# EAGLE design nand (EAGLE 9.5.0)
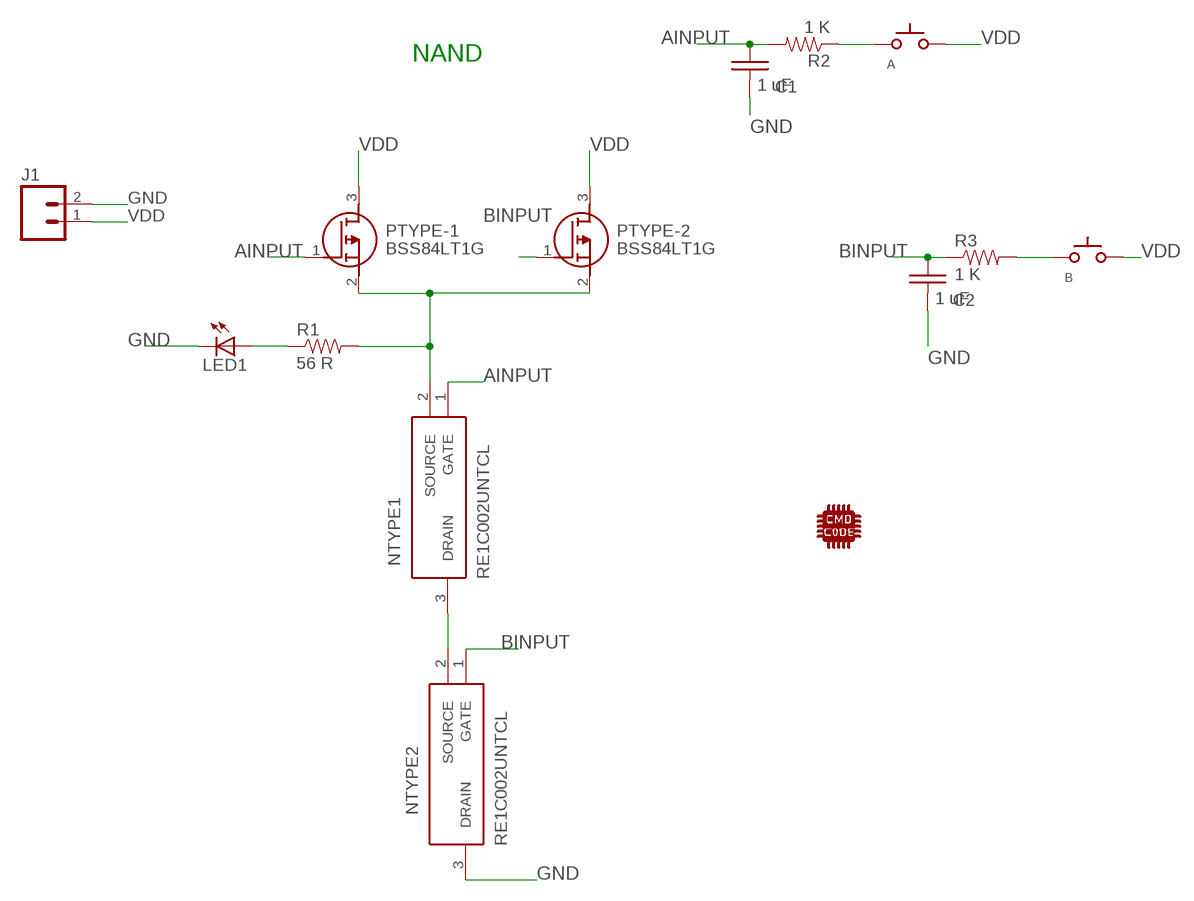
[diagram p0: schematic, sheet 1]

## Parts
A  SWITCH_TACTILETACTILE-2PIN-NARROW  [TACTILE-2PIN-NARROW]
B  SWITCH_TACTILETACTILE-2PIN-NARROW  [TACTILE-2PIN-NARROW]
C1  1 uF  C-USC1206  [C1206]
C2  1 uF  C-USC1206  [C1206]
J1  M021X02_NO_SILK  [1X02_NO_SILK]
LED1  LED3MM  [LED3MM]
NTYPE1  RE1C002UNTCL  [SOT50P160X85-3N]
NTYPE2  RE1C002UNTCL  [SOT50P160X85-3N]
PTYPE-1  BSS84LT1G  [SOT96P237X111-3N]
PTYPE-2  BSS84LT1G  [SOT96P237X111-3N]
R1  56 R  RESISTOR1206  [1206]
R2  1 K  RESISTOR0805-RES  [0805]
R3  1 K  RESISTOR0805-RES  [0805]
U$1  CMD_C0DE_LOGOCMD_CODE_LOGO_TOP_COPPER  [CMD_C0DE_LOGO_TOP_COPPER]

## Nets
AINPUT: C1.1 NTYPE1.1(GATE) PTYPE-1.1(G) R2.2
BINPUT: C2.1 NTYPE2.1(GATE) PTYPE-2.1(G) R3.1
GND: C1.2 C2.2 J1.2 LED1.K(C) NTYPE2.3(DRAIN)
N$1: A.P$2(C) R2.1
N$3: NTYPE1.2(SOURCE) PTYPE-1.2(S) PTYPE-2.2(S) R1.2
N$4: NTYPE1.3(DRAIN) NTYPE2.2(SOURCE)
N$5: LED1.A R1.1
N$7: B.P$2(C) R3.2
VDD: A.P$1(A) B.P$1(A) J1.1 PTYPE-1.3(D) PTYPE-2.3(D)

## Notes on the sheet
- NAND

## Library data of the parts
A B = switches:SWITCH_TACTILE
C1 C2 = passives:C-US: CAPACITOR, American symbol
J1 = connector:M02: Standard 2-pin 0.1" header. Use with - straight break away headers ( PRT-00116) - right angle break away headers (PRT-00553) - swiss pins (PRT-00743) - machine pins (PRT-00117) - female headers (PRT-00115) Molex polarized connector foot print use with: PRT-08233 with associated crimp pins and housings. 2.54_SCREWTERM for use with PRT-10571. 3.5mm Screw Terminal footprints for PRT-08084 5mm Screw Terminal footprints for use with PRT-08432
LED1 = leds:LED: LEDs Standard schematic elements and footprints for 5mm, 3mm, 1206, and 0603 sized LEDs. 5mm - Spark Fun Electronics SKU : COM-00529 (and others)
NTYPE1 NTYPE2 = transitors:RE1C002UNTCL: MOSFET 1.2V Drive Nch MOSFET Source: Datasheet <https://componentsearchengine.com/Datasheets/1/RE1C002UNTCL.pdf>; DESCRIPTION: MOSFET 1.2V Drive Nch MOSFET; HEIGHT: 0.85mm; MANUFACTURER_NAME: ROHM Semiconductor; MANUFACTURER_PART_NUMBER: RE1C002UNTCL; MOUSER_PART_NUMBER: 755-RE1C002UNTCL; MOUSER_PRICE-STOCK: https://www.mouser.com/Search/Refine.aspx?Keyword=755-RE1C002UNTCL
PTYPE-1 PTYPE-2 = transitors:BSS84LT1G: MOSFET 50V 130mA P-Channel Source: Datasheet <https://componentsearchengine.com/Datasheets/1/BSS84LT1G.pdf>; DESCRIPTION: MOSFET 50V 130mA P-Channel; HEIGHT: 1.11mm; MANUFACTURER_NAME: ON Semiconductor; MANUFACTURER_PART_NUMBER: BSS84LT1G; MOUSER_PART_NUMBER: 863-BSS84LT1G; MOUSER_PRICE-STOCK: https://www.mouser.com/Search/Refine.aspx?Keyword=863-BSS84LT1G
R1-R3 = passives:RESISTOR: Resistor Basic schematic elements and footprints for 0603, 1206, and PTH resistors.
U$1 = logos:CMD_C0DE_LOGO

## Board
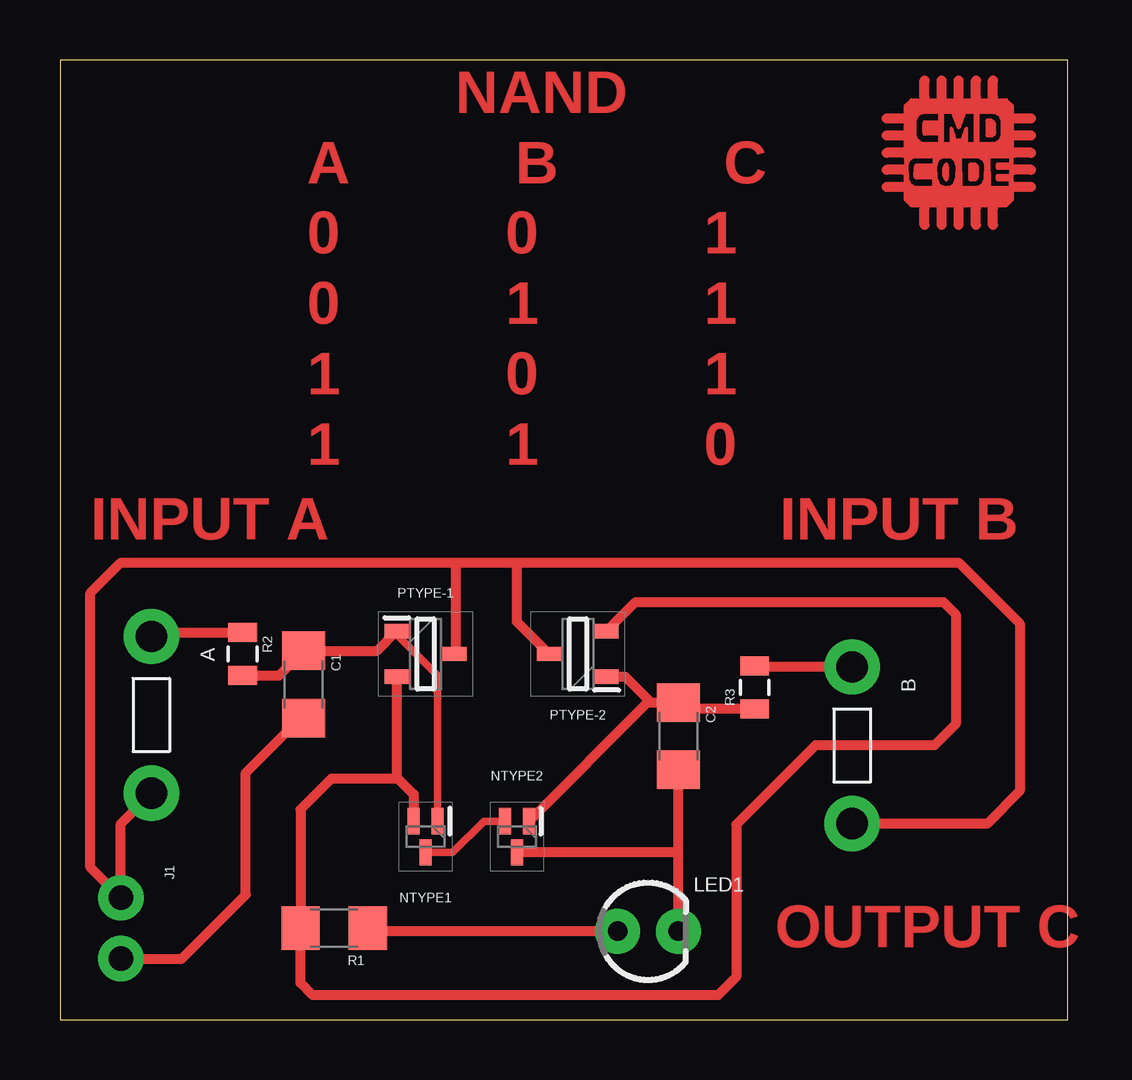
[diagram p1: board, top side]
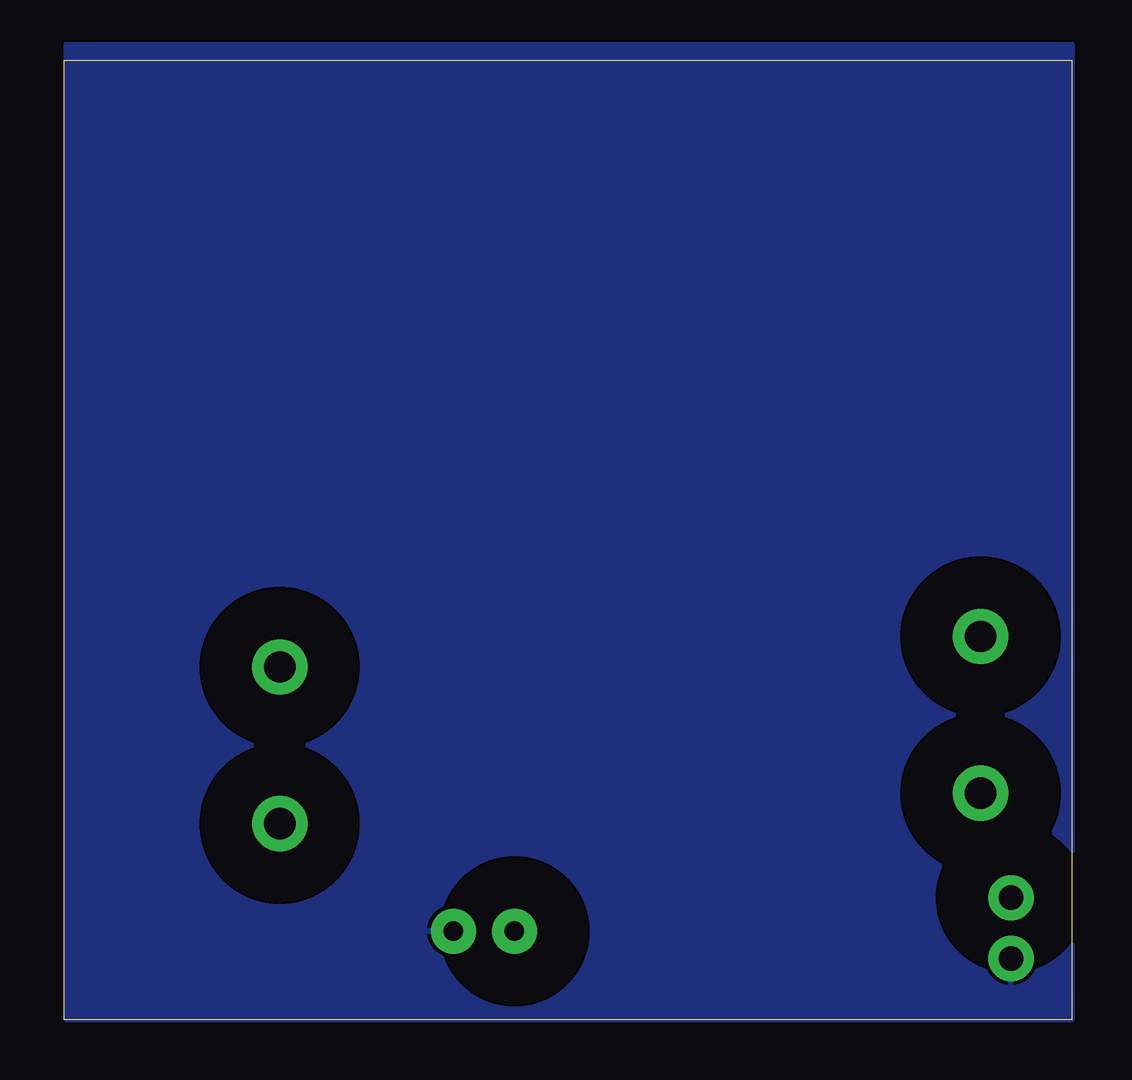
[diagram p2: board, bottom side, seen from below]

Size 42 x 40 mm. Coordinates in mm from the lower left corner, seen from the top.
Outline: 0,0 42,0 42,40 0,40 0,0
Copper layers (1*16): Top 0.035mm / dielectric 1.5mm / Bottom 0.035mm
Design rules "OthermillDRC_30_deg_v2": minimum track width 6mil, minimum drill 0.8mm, track to track 6mil, track to pad 6mil, pad to pad 6mil, via to via 6mil, smd to smd 0mil, copper to edge 0mil, drill to drill 6mil, minimum pad ring 10mil, minimum via ring 10mil, stop-mask expansion 1mil, vias tented up to drill 30mil, thermal gap 6mil

### Footprints (pad centres in the part's own frame; a part is rotated, then mirrored left to right if it is on the bottom)
TACTILE-2PIN-NARROW = drill 1.3 pad 2.3: P$1 3.264,0; P$2 -3.264,0
C1206 = smd 1.6 x 1.8: 1 -1.4,0; 2 1.4,0
1X02_NO_SILK = drill 1.016 pad 1.88: 1 0,0; 2 2.54,0
LED3MM = drill 0.813 pad 1.88: A -1.27,0; K 1.27,0
SOT50P160X85-3N = smd 1.1 x 0.5: 1 -0.65,0.5; 2 -0.65,-0.5; 3 0.65,0
SOT96P237X111-3N = smd 1 x 0.6: 1 -1.2,0.955; 2 -1.2,-0.955; 3 1.2,0
1206 = smd 1.6 x 1.8: 1 -1.4,0; 2 1.4,0
0805 = smd 0.8 x 1.2: 1 -0.9,0; 2 0.9,0

### Placement (x,y rotation side)
A  3.81,12.7 270 top
B  33.02,11.43 270 top
C1  10.16,13.97 270 top
C2  25.78,11.81 270 top
J1  2.54,5.08 270 top
LED1  24.51,3.68 0 top
NTYPE1  15.24,7.62 270 top
NTYPE2  19.05,7.62 270 top
PTYPE-1  15.24,15.24 0 top
PTYPE-2  21.59,15.24 180 top
R1  11.43,3.81 180 top
R2  7.62,15.24 270 top
R3  28.96,13.84 90 top
U$1  37.47,36.45 0 top

### Tracks (layer width: path | path; a pad name or v marks a point on that pad's centre or on a via)
AINPUT
  Top 0.254: PTYPE-1.1 14.04,16.06 | NTYPE1.1
  Top 0.305: 14.04,16.06 15.75,14.35 NTYPE1.1
  Top 0.406: R2.2 9.13,14.34 C1.1 13.21,15.37 PTYPE-1.1
BINPUT
  Top 0.152: 26.05,12.94 C2.1 | 24.49,13.21 24.64,13.21
  Top 0.406: R3.1 26.05,12.94 | PTYPE-2.1 23.56,14.29 24.64,13.21 C2.1 | NTYPE2.1 24.49,13.21
GND
  Top 0.254: 10.03,12.57 C1.2
  Top 0.406: 25.78,6.97 NTYPE2.3 | LED1.K 25.78,6.97 | 25.78,6.97 C2.2 | J1.2 5.08,2.54 7.75,5.21 7.75,10.29 10.03,12.57
  pour Bottom (isolate 2.184): 0,40.64 0,0 41.91,0 41.91,40.64
N$1
  Top 0.406: A.P$2 3.99,16.14 R2.1
N$3
  Top 0.254: 14.04,10.09 13.98,10.03
  Top 0.406: PTYPE-1.2 14.04,10.09 14.74,9.39 NTYPE1.2 | PTYPE-2.2 23.99,17.4 36.83,17.4 37.34,16.89 37.34,12.32 36.45,11.43 31.5,11.43 28.19,8.13 28.19,1.78 27.43,1.02 10.54,1.02 10.03,1.53 R1.2 10.03,8.76 11.3,10.03 13.98,10.03
N$4
  Top 0.305: NTYPE1.3 16.37,6.97 17.67,8.27 NTYPE2.2
N$5
  Top 0.254: R1.1 12.96,3.68
  Top 0.406: LED1.A 12.96,3.68
N$7
  Top 0.152: 29,14.69 R3.2
  Top 0.406: B.P$2 29,14.69
VDD
  Top 0.152: PTYPE-1.3 16.51,15.31
  Top 0.406: 16.51,19.05 2.54,19.05 1.27,17.78 1.27,6.35 J1.1 2.54,8.17 A.P$1 | 16.51,19.05 19.05,19.05 | 19.05,19.05 37.47,19.05 40.01,16.51 40.01,9.53 38.65,8.17 B.P$1 | 16.51,15.31 16.51,19.05 | PTYPE-2.3 19.05,16.58 19.05,19.05

### Text on the board
Top: NAND / A B C / 0 0 1 / 0 1 1 / 1 0 1 / 1 1 0 | INPUT A | INPUT B | OUTPUT C